# EasyEDA Pro project PCB_IGEM.epro

# Schematic Schematic1
Create Date: 2023-09-22; Page Name: P1; Project Name: igem2; Schematic Name: Schematic1; Update Date: 2023-10-02; Company: 嘉立创EDA; Page Size: A4; Version: V1.0
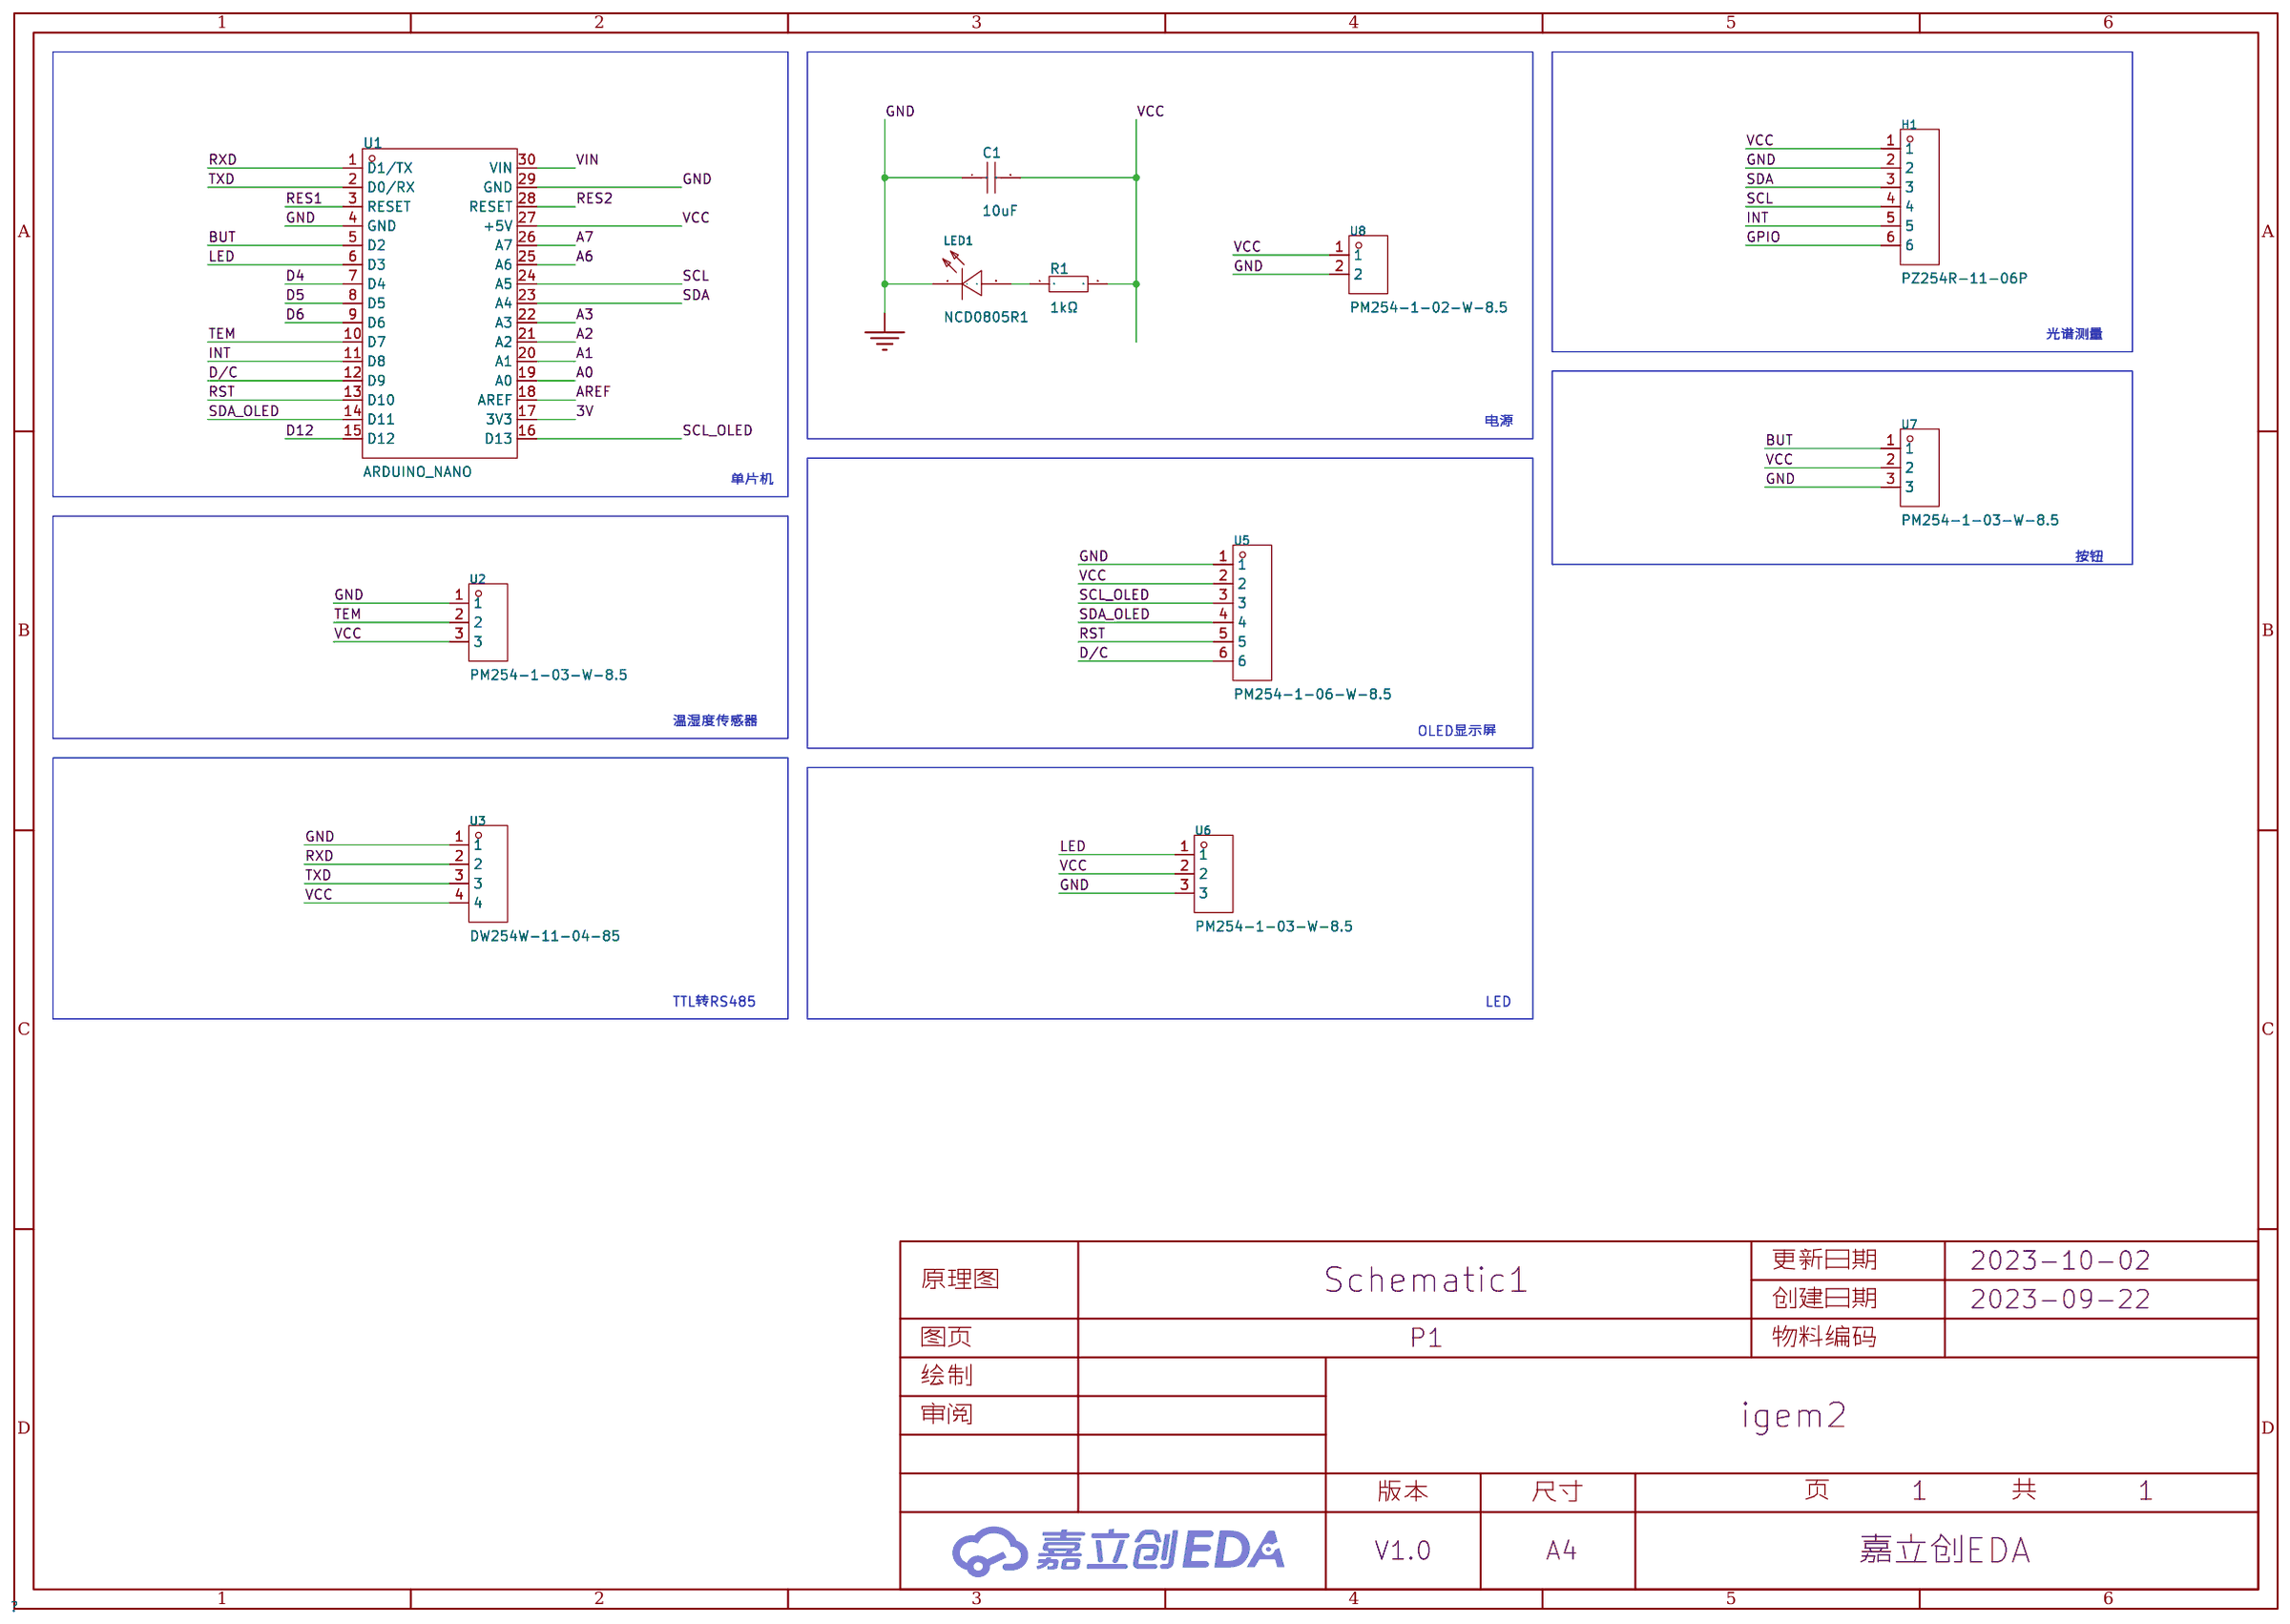
[diagram p0: schematic sheet]

## Parts
C1  10uF  [C0805]
H1  PZ254R-11-06P  [HDR-TH_6P-P2.54-H-M-W10.4]
LED1  NCD0805R1  [LED0805-RD_RED]
R1  1kΩ  [R0805]
U1  ARDUINO_NANO  [COMM-TH_ARDUINO_NANO]
U2  PM254-1-03-W-8.5  [HDR-TH_3P-P2.54-H-F-W10.0-N]
U3  DW254W-11-04-85  [HDR-TH_4P-P2.54-H-F-W10.3-N]
U5  PM254-1-06-W-8.5  [HDR-TH_6P-P2.54-H-F-W10.0-N]
U6  PM254-1-03-W-8.5  [HDR-TH_3P-P2.54-H-F-W10.0-N]
U7  PM254-1-03-W-8.5  [HDR-TH_3P-P2.54-H-F-W10.0-N]
U8  PM254-1-02-W-8.5  [HDR-TH_2P-P2.54-H-F-W10.0-N]

## Library data of the parts
C1 = CL21A106KAYNNNE_C15850: 容值:10uF;精度:±10%;额定电压:25V;材质(温度系数):X5R;; LCSC Part Name: 10uF ±10% 25V; Supplier Part: C15850; Manufacturer: SAMSUNG(三星); Manufacturer Part: CL21A106KAYNNNE; Supplier Footprint: 0805; JLCPCB Part Class: 基础库; Datasheet: https://atta.szlcsc.com/upload/public/pdf/source/20160103/1457707679302.pdf; Supplier: LCSC; Tolerance: ±10%; Voltage Rated: 25V; Temperature Coefficient: X5R
H1 = PZ254R-11-06P: 排数:单排;总PIN位数:6P;间距:2.54mm;插针结构:1x6P;行距:-;安装类型:弯插;圆针/方针:方针;额定电流:-;额定电压:-;配合针长度:6mm;塑高:2.5mm;触头材质:黄铜;触头镀层:-;工作温度范围:-40℃~+105℃;颜色:黑色;; LCSC Part Name: 2.54mm 1x6P 弯插 方针; Supplier Part: C492414; Manufacturer: XFCN(兴飞); Supplier Footprint: 弯插,P=2.54mm; JLCPCB Part Class: 扩展库; Datasheet: https://atta.szlcsc.com/upload/public/pdf/source/20200309/C492414_188252315A8FC19F8382BF484DD4F4B8.pdf; Supplier: LCSC; Number of Rows: 单排; Number of Pins: 6P; Pitch: 2.54mm; Pin Structure: 1x6P; Mounting Type: 弯插; Circluar Pins/Square Pins: 方针; Length of Mating Pin: 6mm; Insulation Height: 2.5mm; Contact Material: 黄铜; Operating Temperature Range: -40℃~+105℃; Color: 黑色
LED1 = NCD0805R1: 发光颜色:红灯;; LCSC Part Name: 红灯; Supplier Part: C84256; Manufacturer: 国星光电; Supplier Footprint: 0805; JLCPCB Part Class: Basic Part; Datasheet: https://atta.szlcsc.com/upload/public/pdf/source/20200820/C84256_F0A75A43B3EAD75808600A0514C76B99.pdf; Supplier: LCSC; Emitted Color: 红灯
R1 = 0805W8F1001T5E: 电阻类型:厚膜电阻;阻值:1kΩ;精度:±1%;功率:125mW;; LCSC Part Name: 1kΩ ±1% 125mW; Supplier Part: C17513; Manufacturer: UNI-ROYAL(厚声); Supplier Footprint: 0805; JLCPCB Part Class: Basic Part; Datasheet: https://atta.szlcsc.com/upload/public/pdf/source/20200306/C422600_1E6D84923E4A46A82E41ADD87F860B5C.pdf; Supplier: LCSC; Type: 厚膜电阻; Tolerance: ±1%; Power(Watts): 125mW; Temperature Coefficient: ±100ppm/℃; Overload Voltage (Max): 150V; Operating Temperature Range: -55℃~+155℃
U1 = ARDUINO_NANO: Supplier Part: C9900017879; Supplier Footprint: 插件; JLCPCB Part Class: 扩展库; Datasheet: https://atta.szlcsc.comnull; Supplier: LCSC
U2 U6 U7 = PM254-1-03-W-8.5: 排数:单排;总孔位数:3P;间距:2.54mm;插孔结构:1x3P;行距:-;安装类型:弯插;圆孔/方孔:方孔;额定电流:3A;额定电压:-;插孔方向:侧面;塑高:8.5mm;工作温度范围:-40℃~+105℃;; LCSC Part Name: 2.54mm 1x3P; Supplier Part: C2897385; Manufacturer: HCTL(华灿天禄); Supplier Footprint: 弯插,P=2.54mm; JLCPCB Part Class: 扩展库; Datasheet: https://atta.szlcsc.com/upload/public/pdf/source/20230609/7BA40A3D721268A082DCDEAD4C99131B.pdf; Supplier: LCSC; Number of Rows: 单排; Number of Holes: 3P; Pitch: 2.54mm; Holes Structure: 1x3P; Mounting Type: 弯插; Circular Hole / Square Hole: 方孔; Current Rating (Max): 3A; Holes Direction: 侧面; Insulation Height: 8.5mm; Operating Temperature Range: -40℃~+105℃
U3 = DW254W-11-04-85: 排数:单排;总孔位数:4P;间距:2.54mm;插孔结构:1x4P;行距:-;安装类型:弯插;圆孔/方孔:方孔;额定电流:3A;额定电压:-;插孔方向:侧面;塑高:8.5mm;工作温度范围:-;; LCSC Part Name: 2.54mm 1x4P; Supplier Part: C2935994; Manufacturer: DEALON(德艺隆); Supplier Footprint: 弯插,P=2.54mm; JLCPCB Part Class: Extended Part; Datasheet: https://atta.szlcsc.com/upload/public/pdf/source/20211231/3C4D2E6B78ED2773EE45870C43BA2BC5.pdf; Supplier: LCSC; Number of Rows: 单排; Number of Holes: 4P; Pitch: 2.54mm; Holes Structure: 1x4P; Mounting Type: 弯插; Circular Hole / Square Hole: 方孔; Current Rating (Max): 3A; Holes Direction: 侧面; Insulation Height: 8.5mm
U5 = PM254-1-06-W-8.5: 间距:2.54mm;总孔位数:6;排数:1;插孔结构:1x6P;行距:-;安装类型:弯插;圆孔/方孔:方孔;额定电流:3A;额定电压:-;插孔方向:侧面;塑高:8.5mm;工作温度范围:-40℃~+105℃;; LCSC Part Name: 2.54mm 1x6P; Supplier Part: C2897388; Manufacturer: HCTL(华灿天禄); Supplier Footprint: 弯插,P=2.54mm; JLCPCB Part Class: 扩展库; Supplier: LCSC; Pitch: 2.54mm; Number of Holes: 6; Number of Rows: 1; Holes Structure: 1x6P; Mounting Type: 弯插; Circular Hole / Square Hole: 方孔; Current Rating (Max): 3A; Holes Direction: 侧面; Insulation Height: 8.5mm; Operating Temperature Range: -40℃~+105℃
U8 = PM254-1-02-W-8.5: 排数:单排;总孔位数:2P;间距:2.54mm;插孔结构:1x2P;行距:-;安装类型:弯插;圆孔/方孔:方孔;额定电流:3A;额定电压:-;插孔方向:侧面;塑高:8.5mm;工作温度范围:-40℃~+105℃;; LCSC Part Name: 2.54mm 1x2P; Supplier Part: C2897384; Manufacturer: HCTL(华灿天禄); Supplier Footprint: 弯插,P=2.54mm; JLCPCB Part Class: Extended Part; Datasheet: https://atta.szlcsc.com/upload/public/pdf/source/20230609/7BA40A3D721268A082DCDEAD4C99131B.pdf; Supplier: LCSC; Number of Rows: 单排; Number of Holes: 2P; Pitch: 2.54mm; Holes Structure: 1x2P; Mounting Type: 弯插; Circular Hole / Square Hole: 方孔; Current Rating (Max): 3A; Holes Direction: 侧面; Insulation Height: 8.5mm; Operating Temperature Range: -40℃~+105℃

## Nets
3V: U1.17(3V3)
GND: C1.1 H1.2 LED1.1(-) U1.4(GND) U1.29(GND) U2.1 U3.1 U5.1 U6.3 U7.3 U8.2
VCC: C1.2 H1.1 R1.2 U1.27(+5V) U2.3 U3.4 U5.2 U6.2 U7.2 U8.1
VIN: U1.30(VIN)
A0: U1.19(A0)
A1: U1.20(A1)
A2: U1.21(A2)
A3: U1.22(A3)
A6: U1.25(A6)
A7: U1.26(A7)
AREF: U1.18(AREF)
BUT: U1.5(D2) U7.1
D4: U1.7(D4)
D5: U1.8(D5)
D6: U1.9(D6)
D12: U1.15(D12)
D/C: U1.12(D9) U5.6
GPIO: H1.6
INT: H1.5 U1.11(D8)
LED: U1.6(D3) U6.1
RES1: U1.3(RESET)
RES2: U1.28(RESET)
RST: U1.13(D10) U5.5
RXD: U1.1(D1/TX) U3.2
SCL: H1.4 U1.24(A5)
SCL_OLED: U1.16(D13) U5.3
SDA: H1.3 U1.23(A4)
SDA_OLED: U1.14(D11) U5.4
TEM: U1.10(D7) U2.2
TXD: U1.2(D0/RX) U3.3
$1N866: LED1.2(+) R1.1

## Notes on the sheet
- 光谱测量
- 电源
- 单片机
- 按钮
- 温湿度传感器
- OLED显示屏
- TTL转RS485
- LED

# Board PCB1
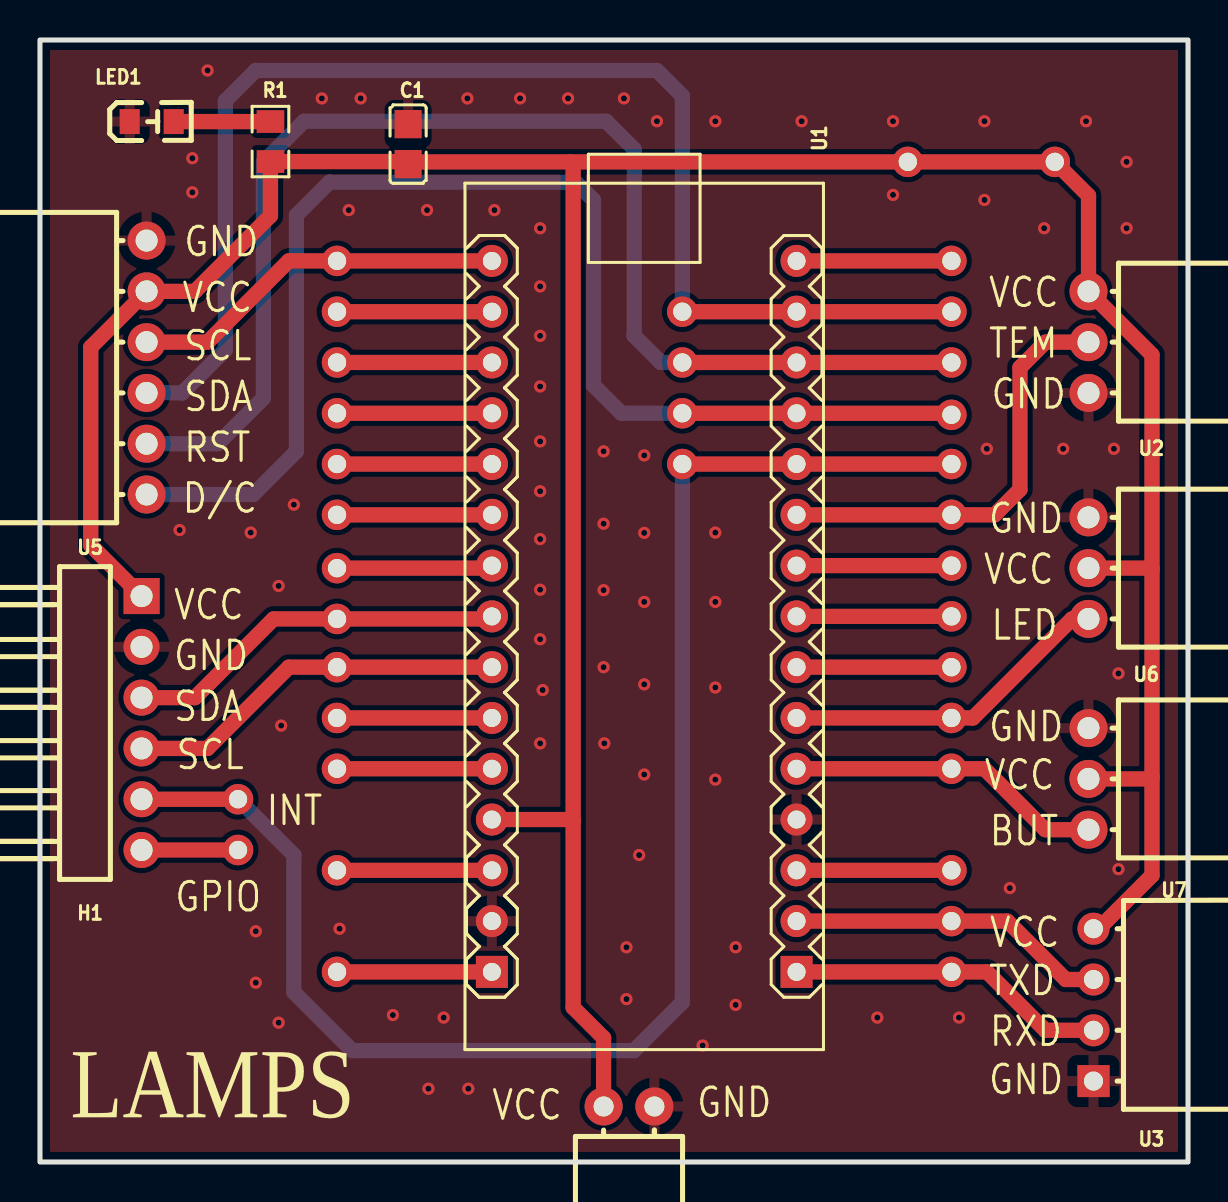
[diagram p1: board, top side]
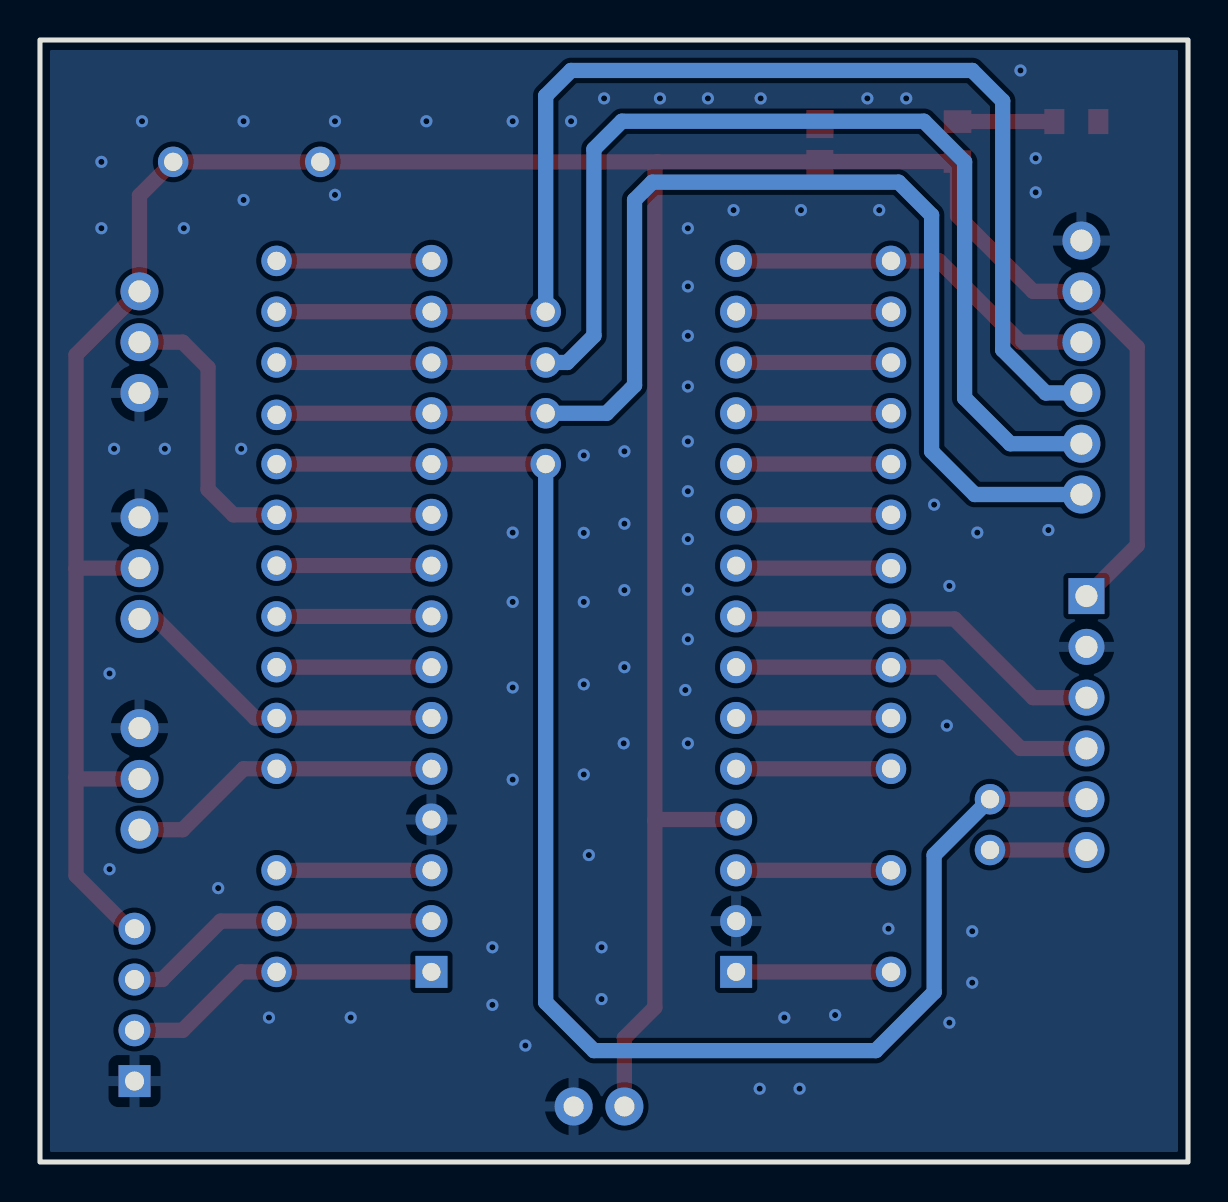
[diagram p2: board, bottom side, seen from below]

Outline 57.43 x 56.12 mm; copper layers: Top Layer, Bottom Layer. Coordinates in mm from the lower left corner of the outline.
Outline path: rectangle 0,56.12 57.43,0
Stack: Top Layer 0.035mm / Dielectric1 1.51mm FR4 er 4.5 / Bottom Layer 0.035mm

## Design rules (mm)
template: 自定义配置
spacing copperThickness1oz (default): track to track 0.254, other pairs 0.254 to 0.3
spacing copperThickness2oz: track to track 0.203, other pairs 0.152 to 0.3
track width copperThickness1oz (default): min 0.127, default 0.254, max 2.54
track width copperThickness2oz: min 0.203, default 0.254, max 2.54
differential pair differentialPair (default): width min 0.127, default 0.254, max 2.54; gap min 0.152, default 0.152
via viaSize (default): diameter min 0.5, default 0.61, max 10; hole min 0.3, default 0.305, max 6.299

## Placement (name value [footprint] x y rotation side)
C1  10uF  [C0805]  18.42 50.91 270 top
H1  PZ254R-11-06P  [HDR-TH_6P-P2.54-H-M-W10.4]  5.08 21.95 270 top
LED1  NCD0805R1  [LED0805-RD_RED]  5.59 52.04 0 top
NOREF  -  [Pad_e134]  45.59 12.05 0 top
NOREF#2  -  [Pad_e176]  9.91 15.6 0 top
NOREF#3  -  [Pad_e132]  14.86 9.51 0 top
NOREF#4  -  [Pad_e210]  32.13 42.53 0 top
NOREF#5  -  [Pad_e140]  45.59 29.83 0 top
NOREF#6  -  [Pad_e167]  9.91 18.14 0 top
NOREF#7  -  [Pad_e136]  45.59 19.67 0 top
NOREF#8  -  [Pad_e121]  14.86 29.7 0 top
NOREF#9  -  [Pad_e119]  14.86 34.91 0 top
NOREF#10  -  [Pad_e143]  45.59 37.37 0 top
NOREF#11  -  [Pad_e391]  43.41 50.02 0 top
NOREF#12  -  [Pad_e138]  45.59 24.75 0 top
NOREF#13  -  [Pad_e139]  45.59 27.29 0 top
NOREF#14  -  [Pad_e131]  14.86 14.59 0 top
NOREF#15  -  [Pad_e144]  45.59 39.99 0 top
NOREF#16  -  [Pad_e168]  32.13 34.91 0 top
NOREF#17  -  [Pad_e137]  45.59 22.21 0 top
NOREF#18  -  [Pad_e120]  14.86 32.37 0 top
NOREF#19  -  [Pad_e133]  45.59 9.51 0 top
NOREF#20  -  [Pad_e129]  14.86 22.21 0 top
NOREF#21  -  [Pad_e128]  14.86 24.75 0 top
NOREF#22  -  [Pad_e130]  14.86 19.67 0 top
NOREF#23  -  [Pad_e116]  14.86 42.53 0 top
NOREF#24  -  [Pad_e395]  50.76 50.02 0 top
NOREF#25  -  [Pad_e141]  45.59 32.37 0 top
NOREF#26  -  [Pad_e208]  32.13 37.45 0 top
NOREF#27  -  [Pad_e117]  14.86 39.99 0 top
NOREF#28  -  [Pad_e122]  14.86 27.16 0 top
NOREF#29  -  [Pad_e57]  14.86 45.07 0 top
NOREF#30  -  [Pad_e146]  45.59 45.07 0 top
NOREF#31  -  [Pad_e142]  45.59 34.91 0 top
NOREF#32  -  [Pad_e135]  45.59 14.59 0 top
NOREF#33  -  [Pad_e209]  32.13 39.99 0 top
NOREF#34  -  [Pad_e145]  45.59 42.53 0 top
NOREF#35  -  [Pad_e118]  14.86 37.45 0 top
R1  1kΩ  [R0805]  11.53 51.04 270 top
U1  ARDUINO_NANO  [COMM-TH_ARDUINO_NANO]  30.23 27.29 270 top
U2  PM254-1-03-W-8.5  [HDR-TH_3P-P2.54-H-F-W10.0-N]  52.45 41 90 top
U3  DW254W-11-04-85  [HDR-TH_4P-P2.54-H-F-W10.3-N]  52.7 7.86 90 top
U5  PM254-1-06-W-8.5  [HDR-TH_6P-P2.54-H-F-W10.0-N]  5.33 39.73 270 top
U6  PM254-1-03-W-8.5  [HDR-TH_3P-P2.54-H-F-W10.0-N]  52.45 29.7 90 top
U7  PM254-1-03-W-8.5  [HDR-TH_3P-P2.54-H-F-W10.0-N]  52.45 19.16 90 top
U8  PM254-1-02-W-8.5  [HDR-TH_2P-P2.54-H-F-W10.0-N]  29.46 2.78 0 top

## Footprints (pads in the part's own frame, mm; a bottom-side part is the same pattern mirrored in y, then rotated)
C0805
  rect 1.41x1.35 smd: 1(-1,0) 2(1,0)
COMM-TH_ARDUINO_NANO
  rect 1.6x1.6 hole 0.9: 1(17.78,7.62) 30(17.78,-7.62)
  round 1.6 hole 0.9: 2(15.24,7.62) 3(12.7,7.62) 4(10.16,7.62) 5(7.62,7.62) 6(5.08,7.62) 7(2.54,7.62) 8(0,7.62) 9(-2.54,7.62) 10(-5.08,7.62) 11(-7.62,7.62) 12(-10.16,7.62) 13(-12.7,7.62) 14(-15.24,7.62) 15(-17.78,7.62) 16(-17.78,-7.62) 17(-15.24,-7.62) 18(-12.7,-7.62) 19(-10.16,-7.62) 20(-7.62,-7.62) 21(-5.08,-7.62) 22(-2.54,-7.62) 23(0,-7.62) 24(2.54,-7.62) 25(5.08,-7.62) 26(7.62,-7.62) 27(10.16,-7.62) 28(12.7,-7.62) 29(15.24,-7.62)
HDR-TH_2P-P2.54-H-F-W10.0-N
  round 1.9 hole 1: 1(-1.27,0) 2(1.27,0)
HDR-TH_3P-P2.54-H-F-W10.0-N
  round 1.9 hole 1.1: 1(-2.54,0) 2(0,0) 3(2.54,0)
HDR-TH_4P-P2.54-H-F-W10.3-N
  rect 1.6x1.6 hole 0.95: 1(-3.81,0)
  round 1.6 hole 0.95: 2(-1.27,0) 3(1.27,0) 4(3.81,0)
HDR-TH_6P-P2.54-H-F-W10.0-N
  round 1.9 hole 1.1: 1(-6.35,0) 2(-3.81,0) 3(-1.27,0) 4(1.27,0) 5(3.81,0) 6(6.35,0)
HDR-TH_6P-P2.54-H-M-W10.4
  rect 1.8x1.8 hole 1.1: 1(-6.35,0)
  round 1.8 hole 1.1: 2(-3.81,0) 3(-1.27,0) 4(1.27,0) 5(3.81,0) 6(6.35,0)
LED0805-RD_RED
  rect 1x1.25 smd: 1(-1.1,0) 2(1.1,0)
Pad_e57
  round 1.524 hole 0.914: 31(0,0)
Pad_e116
  round 1.524 hole 0.914: 32(0,0)
Pad_e117
  round 1.524 hole 0.914: 33(0,0)
Pad_e118
  round 1.524 hole 0.914: 34(0,0)
Pad_e119
  round 1.524 hole 0.914: 35(0,0)
Pad_e120
  round 1.524 hole 0.914: 36(0,0)
Pad_e121
  round 1.524 hole 0.914: 37(0,0)
Pad_e122
  round 1.524 hole 0.914: 38(0,0)
Pad_e128
  round 1.524 hole 0.914: 39(0,0)
Pad_e129
  round 1.524 hole 0.914: 40(0,0)
Pad_e130
  round 1.524 hole 0.914: 41(0,0)
Pad_e131
  round 1.524 hole 0.914: 42(0,0)
Pad_e132
  round 1.524 hole 0.914: 43(0,0)
Pad_e133
  round 1.524 hole 0.914: 44(0,0)
Pad_e134
  round 1.524 hole 0.914: 45(0,0)
Pad_e135
  round 1.524 hole 0.914: 46(0,0)
Pad_e136
  round 1.524 hole 0.914: 47(0,0)
Pad_e137
  round 1.524 hole 0.914: 48(0,0)
Pad_e138
  round 1.524 hole 0.914: 49(0,0)
Pad_e139
  round 1.524 hole 0.914: 50(0,0)
Pad_e140
  round 1.524 hole 0.914: 51(0,0)
Pad_e141
  round 1.524 hole 0.914: 52(0,0)
Pad_e142
  round 1.524 hole 0.914: 53(0,0)
Pad_e143
  round 1.524 hole 0.914: 54(0,0)
Pad_e144
  round 1.524 hole 0.914: 55(0,0)
Pad_e145
  round 1.524 hole 0.914: 56(0,0)
Pad_e146
  round 1.524 hole 0.914: 57(0,0)
Pad_e167
  round 1.524 hole 0.914: 59(0,0)
Pad_e168
  round 1.524 hole 0.914: 60(0,0)
Pad_e176
  round 1.524 hole 0.914: 61(0,0)
Pad_e208
  round 1.524 hole 0.914: 62(0,0)
Pad_e209
  round 1.524 hole 0.914: 63(0,0)
Pad_e210
  round 1.524 hole 0.914: 64(0,0)
Pad_e391
  round 1.524 hole 0.914: 1(0,0)
Pad_e395
  round 1.524 hole 0.914: 58(0,0)
R0805
  rect 1.133x1.377 smd: 1(-1,0) 2(1,0)

## Nets
3V: NOREF#23.32 U1.17
GND: C1.1 H1.2 LED1.1 U1.4 U1.29 U2.1 U3.1 U5.1 U6.3 U7.3 U8.2
VCC: C1.2 H1.1 NOREF#11.1 NOREF#24.58 R1.2 U1.27 U2.3 U3.4 U5.2 U6.2 U7.2 U8.1
VIN: NOREF#3.43 U1.30
A0: NOREF#35.34 U1.19
A1: NOREF#9.35 U1.20
A2: NOREF#18.36 U1.21
A3: NOREF#8.37 U1.22
A6: NOREF#20.40 U1.25
A7: NOREF#22.41 U1.26
AREF: NOREF#27.33 U1.18
BUT: NOREF#7.47 U1.5 U7.1
D4: NOREF#12.49 U1.7
D5: NOREF#13.50 U1.8
D6: NOREF#5.51 U1.9
D12: NOREF#30.57 U1.15
D/C: NOREF#10.54 NOREF#26.62 U1.12 U5.6
GPIO: H1.6 NOREF#2.61
INT: H1.5 NOREF#6.59 NOREF#16.60 NOREF#31.53 U1.11
LED: NOREF#17.48 U1.6 U6.1
RES1: NOREF#32.46 U1.3
RES2: NOREF#14.42 U1.28
RST: NOREF#15.55 NOREF#33.63 U1.13 U5.5
RXD: NOREF#19.44 U1.1 U3.2
SCL: H1.4 NOREF#21.39 U1.24
SCL_OLED: NOREF#29.31 U1.16 U5.3
SDA: H1.3 NOREF#28.38 U1.23
SDA_OLED: NOREF#4.64 NOREF#34.56 U1.14 U5.4
TEM: NOREF#25.52 U1.10 U2.2
TXD: NOREF.45 U1.2 U3.3
$1N866: LED1.2 R1.1

## Via types
v1: diameter 0.61, hole 0.305, Top Layer to Bottom Layer, 75 vias

## Routing (per net, layer and track width the routed paths; a pad name or vN(x,y) marks a point on that pad's centre or on a via; arc(x,y) is an arc through that point)
3V: length 7.7
  Top Layer w0.762: 22.61,42.53 NOREF#23.32
GND:
  vias: v1(6.98,31.61) v1(7.62,50.2) v1(7.62,48.5) v1(8.38,54.59) v1(10.54,31.48) v1(10.8,11.54) v1(10.8,8.97) v1(11.94,28.81) v1(11.94,6.97) v1(12.07,21.83) v1(12.7,32.88) v1(14.1,53.2) v1(14.99,11.67) v1(15.45,47.61) v1(16.04,53.2) v1(17.65,7.35) v1(19.36,47.61) v1(19.43,3.67) v1(20.19,7.22) v1(21.38,53.2) v1(21.43,3.67) v1(22.73,47.61) v1(24.02,53.2) v1(25.02,46.7) v1(25.02,43.79) v1(25.02,41.32) v1(25.02,38.79) v1(25.02,36.04) v1(25.02,33.55) v1(25.02,31.16) v1(25.02,28.62) v1(25.02,26.15) v1(25.02,20.94) v1(25.15,23.61) v1(26.42,53.2) v1(28.19,35.54) v1(28.19,31.92) v1(28.19,28.6) v1(28.19,24.75) v1(28.23,20.94) v1(29.21,53.2) v1(29.34,10.74) v1(29.34,8.15) v1(29.97,15.35) v1(30.23,35.34) v1(30.23,31.47) v1(30.23,28.01) v1(30.23,23.89) v1(30.23,19.38) v1(30.86,52.05) v1(33.15,5.83) v1(33.78,52.05) v1(33.78,31.48) v1(33.78,28.01) v1(33.78,23.73) v1(33.78,19.12) v1(34.8,10.74) v1(34.8,7.86) v1(38.1,52.05) v1(41.89,7.22) v1(42.67,52.05) v1(42.67,48.37) v1(45.97,7.22) v1(47.24,52.05) v1(47.24,48.12) v1(47.36,35.67) v1(48.51,13.7) v1(50.23,46.7) v1(51.18,35.67) v1(52.32,52.05) v1(53.72,35.67) v1(53.95,24.43) v1(53.95,14.65) v1(54.36,50.02) v1(54.36,46.7)
VCC: length 167.4
  Top Layer w0.762: 26.54,50.02 26.67,49.89 26.67,17.07 ; 26.54,50.02 NOREF#11.1 NOREF#24.58 52.45,48.34 U2.3 55.63,40.37 55.63,29.68 ; 26.54,50.02 18.53,50.02 C1.2 18.29,50.04 R1.2 11.53,47.33 7.75,43.54 U5.2 2.54,40.75 2.54,30.84 5.08,28.3 ; U1.27 26.61,17.13 26.67,17.07 ; U8.1 28.19,6.21 26.67,7.73 26.67,17.07 ; 55.63,19.25 55.54,19.16 U7.2 ; 55.63,19.25 55.63,14.33 52.96,11.67 U3.4 ; 55.63,19.25 55.63,29.68 ; U6.2 55.6,29.7 55.63,29.68
VIN: length 7.7
  Top Layer w0.762: U1.30 NOREF#3.43
A0: length 7.7
  Top Layer w0.762: U1.19 NOREF#35.34
A1: length 7.9
  Top Layer w0.762: 14.73,34.91 U1.20
A2: length 7.7
  Top Layer w0.762: U1.21 NOREF#18.36
A3: length 7.8
  Top Layer w0.762: U1.22 22.48,29.7 NOREF#8.37
A6: length 7.7
  Top Layer w0.762: U1.25 NOREF#20.40
A7: length 7.7
  Top Layer w0.762: U1.26 NOREF#22.41
AREF: length 7.7
  Top Layer w0.762: U1.18 NOREF#27.33
BUT: length 15.9
  Top Layer w0.762: U1.5 NOREF#7.47 47.24,19.67 50.29,16.62 52.45,16.62
D4: length 7.7
  Top Layer w0.762: 37.85,24.75 NOREF#12.49
D5: length 7.7
  Top Layer w0.762: U1.8 NOREF#13.50
D6: length 7.7
  Top Layer w0.762: U1.9 NOREF#5.51
D12: length 7.7
  Top Layer w0.762: U1.15 NOREF#30.57
D/C: length 63.9
  Top Layer w0.762: 45.59,37.45 U1.12 NOREF#26.62
  Bottom Layer w0.762: NOREF#26.62 29.08,37.45 27.69,38.85 27.69,48.12 26.8,49.01 14.48,49.01 12.83,47.35 12.83,35.54 10.67,33.38 U5.6
GPIO: length 4.8
  Top Layer w0.762: H1.6 NOREF#2.61
INT: length 77.9
  Top Layer w0.762: NOREF#16.60 U1.11 NOREF#31.53 ; 5.08,18.14 10.16,18.14
  Bottom Layer w0.762: NOREF#16.60 32.13,7.98 29.72,5.57 15.62,5.57 12.7,8.49 12.7,15.35 NOREF#6.59
LED: length 16.7
  Top Layer w0.762: U1.6 NOREF#17.48 46.67,22.21 51.62,27.16 U6.1
RES1: length 7.7
  Top Layer w0.762: U1.3 NOREF#32.46
RES2: length 7.7
  Top Layer w0.762: U1.28 NOREF#14.42
RST: length 64.3
  Top Layer w0.762: NOREF#33.63 U1.13 NOREF#15.55
  Bottom Layer w0.762: NOREF#33.63 31.05,39.99 29.72,41.32 29.72,50.66 28.32,52.05 13.21,52.05 11.18,50.02 11.18,38.21 8.89,35.92 U5.5
RXD: length 16.1
  Top Layer w0.762: U3.2 50.29,6.59 47.37,9.51 NOREF#19.44 U1.1
SCL: length 19.2
  Top Layer w0.762: H1.4 8.38,20.68 12.45,24.75 NOREF#21.39 22.61,24.75
SCL_OLED: length 19
  Top Layer w0.762: 5.33,41 8.38,41 12.45,45.07 NOREF#29.31 U1.16
SDA: length 19.2
  Top Layer w0.762: U1.23 22.48,27.16 NOREF#28.38 11.68,27.16 7.75,23.22 5.08,23.22
SDA_OLED: length 65.6
  Top Layer w0.762: NOREF#4.64 NOREF#34.56
  Bottom Layer w0.762: U5.4 7.11,38.46 9.27,40.62 9.27,53.07 10.8,54.59 30.86,54.59 32.13,53.32 NOREF#4.64
TEM: length 21.8
  Top Layer w0.762: U2.2 50.29,41 49.02,39.73 49.02,33.64 47.75,32.37 NOREF#25.52 U1.10
TXD: length 16.1
  Top Layer w0.762: U1.2 NOREF.45 48.39,12.05 51.31,9.13 U3.3
$1N866: length 4.8
  Top Layer w0.762: R1.1 LED1.2

## Copper pours and planes (outline as drawn; the poured copper is in the pictures)
GND on Top Layer: -8.13,61.32 71.25,61.32 71.25,-10.94 -8.13,-10.94
GND on Bottom Layer: -7.62,60.94 68.96,60.94 68.96,-10.94 -7.62,-10.94

## Text on the board
Top Silkscreen Layer: VCC | GND | SDA | GPIO | SCL | D/C | RST | INT | TEM | TXD | BUT | RXD | LED | LAMPS
